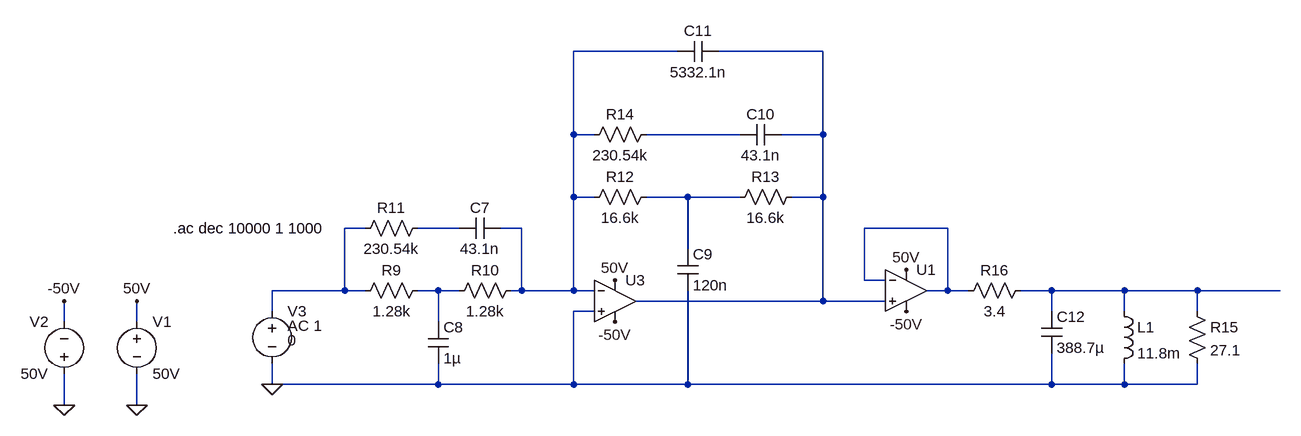
[diagram p0: schematic lt_thor.asc]
lt_thor.asc, the LTspice schematic file:
Version 4
SHEET 1 880 788
WIRE -800 192 -960 192
WIRE -576 192 -736 192
WIRE -960 320 -960 192
WIRE -928 320 -960 320
WIRE -704 320 -848 320
WIRE -576 320 -576 192
WIRE -576 320 -640 320
WIRE -960 416 -960 320
WIRE -928 416 -960 416
WIRE -784 416 -848 416
WIRE -704 416 -784 416
WIRE -576 416 -576 320
WIRE -576 416 -624 416
WIRE -1280 464 -1312 464
WIRE -1136 464 -1200 464
WIRE -1040 464 -1072 464
WIRE -384 464 -512 464
WIRE -784 496 -784 416
WIRE -512 544 -512 464
WIRE -480 544 -512 544
WIRE -1312 560 -1312 464
WIRE -1312 560 -1424 560
WIRE -1280 560 -1312 560
WIRE -1168 560 -1200 560
WIRE -1136 560 -1168 560
WIRE -1040 560 -1040 464
WIRE -1040 560 -1056 560
WIRE -960 560 -960 416
WIRE -960 560 -1040 560
WIRE -928 560 -960 560
WIRE -384 560 -384 464
WIRE -384 560 -416 560
WIRE -352 560 -384 560
WIRE -224 560 -272 560
WIRE -112 560 -224 560
WIRE 0 560 -112 560
WIRE 128 560 0 560
WIRE -576 576 -576 416
WIRE -576 576 -864 576
WIRE -480 576 -576 576
WIRE -1424 592 -1424 560
WIRE -928 592 -960 592
WIRE -224 592 -224 560
WIRE -112 592 -112 560
WIRE 0 592 0 560
WIRE -1744 608 -1744 576
WIRE -1632 608 -1632 576
WIRE -1168 608 -1168 560
WIRE -1424 704 -1424 672
WIRE -1168 704 -1168 672
WIRE -1168 704 -1424 704
WIRE -960 704 -960 592
WIRE -960 704 -1168 704
WIRE -784 704 -784 560
WIRE -784 704 -960 704
WIRE -224 704 -224 656
WIRE -224 704 -784 704
WIRE -112 704 -112 672
WIRE -112 704 -224 704
WIRE 0 704 0 672
WIRE 0 704 -112 704
WIRE -1744 736 -1744 688
WIRE -1632 736 -1632 688
FLAG -1424 704 0
FLAG -1632 576 50V
FLAG -1744 576 -50V
FLAG -1744 736 0
FLAG -1632 736 0
FLAG -896 544 50V
FLAG -448 528 50V
FLAG -896 608 -50V
FLAG -448 592 -50V
SYMBOL res -1184 544 R90
WINDOW 0 0 56 VBottom 2
WINDOW 3 32 56 VTop 2
SYMATTR InstName R9
SYMATTR Value 1.28k
SYMBOL res -1040 544 R90
WINDOW 0 0 56 VBottom 2
WINDOW 3 32 56 VTop 2
SYMATTR InstName R10
SYMATTR Value 1.28k
SYMBOL res -1184 448 R90
WINDOW 0 0 56 VBottom 2
WINDOW 3 32 56 VTop 2
SYMATTR InstName R11
SYMATTR Value 230.54k
SYMBOL cap -1072 448 R90
WINDOW 0 0 32 VBottom 2
WINDOW 3 32 32 VTop 2
SYMATTR InstName C7
SYMATTR Value 43.1n
SYMBOL Opamps/UniversalOpamp2 -896 576 R0
SYMATTR InstName U3
SYMBOL cap -1184 608 R0
SYMATTR InstName C8
SYMATTR Value 1µ
SYMBOL res -832 400 R90
WINDOW 0 0 56 VBottom 2
WINDOW 3 32 56 VTop 2
SYMATTR InstName R12
SYMATTR Value 16.6k
SYMBOL cap -800 496 R0
SYMATTR InstName C9
SYMATTR Value 120n
SYMBOL res -608 400 R90
WINDOW 0 0 56 VBottom 2
WINDOW 3 32 56 VTop 2
SYMATTR InstName R13
SYMATTR Value 16.6k
SYMBOL res -832 304 R90
WINDOW 0 0 56 VBottom 2
WINDOW 3 32 56 VTop 2
SYMATTR InstName R14
SYMATTR Value 230.54k
SYMBOL cap -640 304 R90
WINDOW 0 0 32 VBottom 2
WINDOW 3 32 32 VTop 2
SYMATTR InstName C10
SYMATTR Value 43.1n
SYMBOL cap -736 176 R90
WINDOW 0 0 32 VBottom 2
WINDOW 3 32 32 VTop 2
SYMATTR InstName C11
SYMATTR Value 5332.1n
SYMBOL cap -240 592 R0
SYMATTR InstName C12
SYMATTR Value 388.7µ
SYMBOL ind -128 576 R0
SYMATTR InstName L1
SYMATTR Value 11.8m
SYMBOL res -16 576 R0
SYMATTR InstName R15
SYMATTR Value 27.1
SYMBOL res -256 544 R90
WINDOW 0 0 56 VBottom 2
WINDOW 3 32 56 VTop 2
SYMATTR InstName R16
SYMATTR Value 3.4
SYMBOL voltage -1424 576 R0
WINDOW 123 24 38 Left 2
WINDOW 39 0 0 Left 0
WINDOW 3 24 60 Left 2
SYMATTR Value2 AC 1
SYMATTR Value 0
SYMATTR InstName V3
SYMBOL Opamps/UniversalOpamp2 -448 560 R0
SYMATTR InstName U1
SYMBOL voltage -1632 592 R0
SYMATTR InstName V1
SYMATTR Value 50V
SYMBOL voltage -1744 704 R180
WINDOW 0 24 96 Left 2
WINDOW 3 24 16 Left 2
SYMATTR InstName V2
SYMATTR Value 50V
TEXT -1576 464 Left 2 !.ac dec 10000 1 1000

The netlist it stands for:
* lt_thor.asc
R9 N008 N005 1.28k
R10 N001 N008 1.28k
R11 N006 N005 230.54k
C7 N001 N006 43.1n
XU3 0 N001 50V -50V N002 level.2 Avol=1Meg GBW=10Meg Slew=10Meg ilimit=25m rail=0 Vos=0 phimargin=45 en=0 enk=0 in=0 ink=0 Rin=500Meg  ; pins IN+ IN- V+ V- OUT
C8 N008 0 1µ
R12 N004 N001 16.6k
C9 N004 0 120n
R13 N002 N004 16.6k
R14 N003 N001 230.54k
C10 N002 N003 43.1n
C11 N002 N001 5332.1n
C12 N009 0 388.7µ
L1 N009 0 11.8m
R15 N009 0 27.1
R16 N009 N007 3.4
V3 N005 0 0 AC 1
XU1 N002 N007 50V -50V N007 level.2 Avol=1Meg GBW=10Meg Slew=10Meg ilimit=25m rail=0 Vos=0 phimargin=45 en=0 enk=0 in=0 ink=0 Rin=500Meg  ; pins IN+ IN- V+ V- OUT
V1 50V 0 50V
V2 0 -50V 50V
.ac dec 10000 1 1000
.lib UniversalOpamps2.sub
.backanno
.end